# EAGLE design alfred-core (EAGLE 7.3.0)
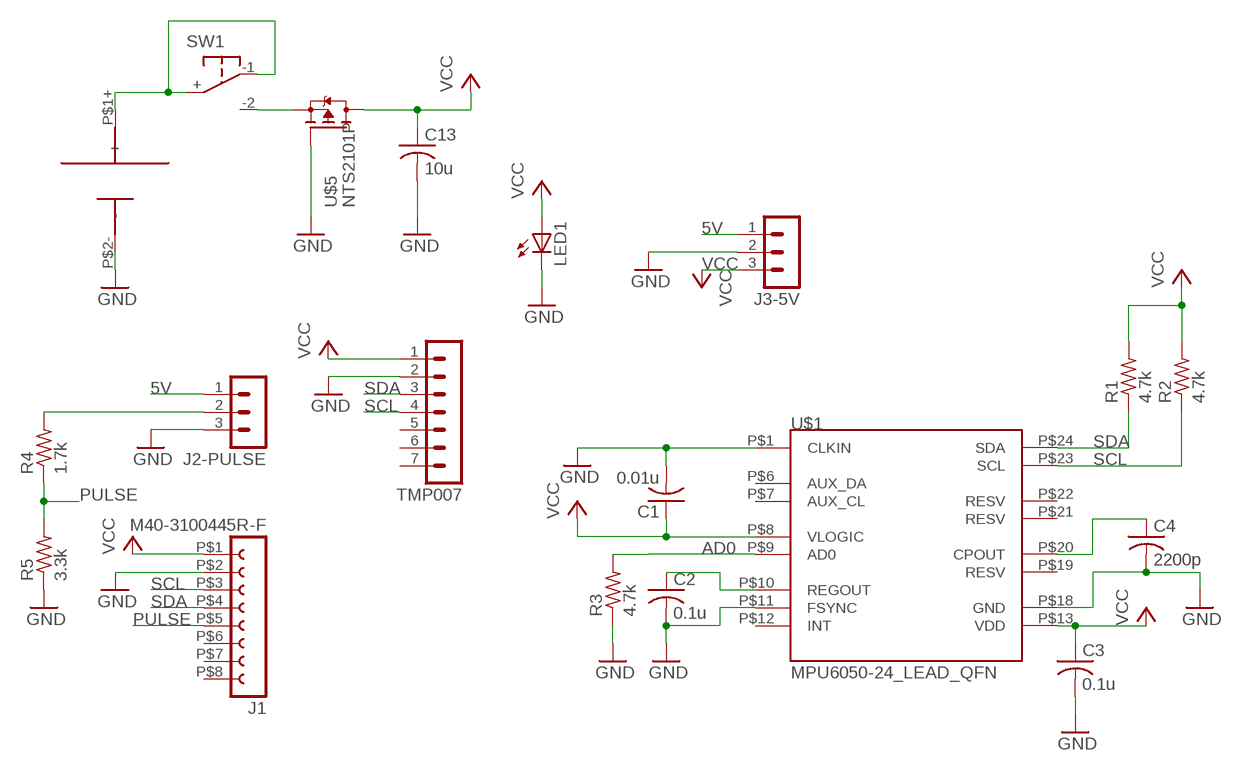
[diagram p0: schematic, sheet 1]

## Parts
BAT1  CR2032HOLDER  [CR2032-HOLDER]
C1  0.01u  C-USC0603  [C0603]
C2  0.1u  C-USC0603  [C0603]
C3  0.1u  C-USC0603  [C0603]
C4  2200p  C-USC0603  [C0603]
C13  10u  C-USC0603  [C0603]
J1  M40-3100445R-F  [8-PO-F]
J2-PULSE  MA03-1  [MA03-1]
J3-5V  MA03-1  [MA03-1]
LED1  LEDCHIPLED_0603  [CHIPLED_0603]
R1  4.7k  R-US_R0603  [R0603]
R2  4.7k  R-US_R0603  [R0603]
R3  4.7k  R-US_R0603  [R0603]
R4  1.7k  R-US_R0603  [R0603]
R5  3.3k  R-US_R0603  [R0603]
SW1  JS102011SAQN  [JS102011SAQN]
TMP007  MA07-1  [MA07-1]
U$1  MPU6050-24_LEAD_QFN  [24_LEAD_QFN(4X4X0.9)]
U$5  NTS2101P  [SOT323]

## Nets
5V: J2-PULSE.1 J3-5V.1
AD0: R3.2 U$1.P$9(AD0)
GND: BAT1.P$2-(-) C1.2 C2.2 C3.2 C4.2 C13.2 J1.P$2 J2-PULSE.3 J3-5V.2 LED1.C R3.1 R5.1 TMP007.2 U$1.P$1(CLKIN) U$1.P$11(FSYNC) U$1.P$18(GND) U$5.G
N$1: C2.1 U$1.P$10(REGOUT)
N$2: C4.1 U$1.P$20(CPOUT)
N$5: J2-PULSE.2 R4.2
N$8: BAT1.P$1+(+) SW1.+ SW1.-1
N$10: SW1.-2 U$5.S
PULSE: J1.P$5 R4.1 R5.2
SCL: J1.P$3 R2.1 TMP007.4 U$1.P$23(SCL)
SDA: J1.P$4 R1.1 TMP007.3 U$1.P$24(SDA)
VCC: C1.1 C3.1 C13.1 J1.P$1 J3-5V.3 LED1.A R1.2 R2.2 TMP007.1 U$1.P$8(VLOGIC) U$1.P$13(VDD) U$5.D
Unconnected: J1.P$6 J1.P$7 J1.P$8 TMP007.5 TMP007.6 TMP007.7 U$1.P$6(AUX_DA) U$1.P$7(AUX_CL) U$1.P$12(INT) U$1.P$19(RESV) U$1.P$21(RESV) U$1.P$22(RESV)

## Library data of the parts
BAT1 = adafruit:CR2032HOLDER
C1-C4 C13 = adafruit:C-US: CAPACITOR, American symbol
J1 = board-to-board-conn:M40-3100445R-F
J2-PULSE J3-5V = con-lstb:MA03-1: PIN HEADER; OC_FARNELL: unknown; OC_NEWARK: unknown
LED1 = adafruit:LED: LED OSRAM: - CHIPLED LG R971, LG N971, LY N971, LG Q971, LY Q971, LO R971, LY R971 LH N974, LH R974 LS Q976, LO Q976, LY Q976 LO Q996 - Hyper CHIPLED LW Q18S LB Q993, LB Q99A, LB R99A - SideLED LS A670, LO A670, LY A670, LG A670, LP A670 LB A673, LV A673, LT A673, LW A673 LH A674 LY A675 LS A676, LA A676, LO A676, LY A676, LW A676 LS A679, LY A679, LG A679 - Hyper Micro SIDELED® LS Y876, LA Y876, LO Y876, LY Y876 LT Y87S - SmartLED LW L88C, LW L88S LB L89C, LB L89S, LG L890 LS L89K, LO L89K, LY L89K LS L896, LA L896, LO L896, LY L896 - TOPLED LS T670, LO T670, LY T670, LG T670, LP T670 LSG T670, LSP T670, LSY T670, LOP T670, LYG T670 LG T671, LOG T671, LSG T671 LB T673, LV T673, LT T673, LW T673 LH T674 LS T676, LA T676, LO T676, LY T676, LB T676, LH T676, LSB T676, LW T676 LB T67C, LV T67C, LT T67C, LS T67K, LO T67K, LY T67K, LW E67C LS E67B, LA E67B, LO E67B, LY E67B, LB E67C, LV E67C, LT E67C LW T67C LS T679, LY T679, LG T679 LS T770, LO T770, LY T770, LG T770, LP T770 LB T773, LV T773, LT T773, LW T773 LH T774 LS E675, LA E675, LY E675, LS T675 LS T776, LA T776, LO T776, LY T776, LB T776 LHGB T686 LT T68C, LB T68C - Hyper Mini TOPLED® LB M676 - Mini TOPLED Santana® LG M470 LS M47K, LO M47K, LY M47K Source: http://www.osram.convergy.de/
R1-R5 = adafruit:R-US_: RESISTOR, American symbol
SW1 = Switched:JS102011SAQN
TMP007 = con-lstb:MA07-1: PIN HEADER; OC_FARNELL: unknown; OC_NEWARK: unknown
U$1 = MPU6050:MPU6050-24_LEAD_QFN
U$5 = adafruit:NTS2101P

## Board
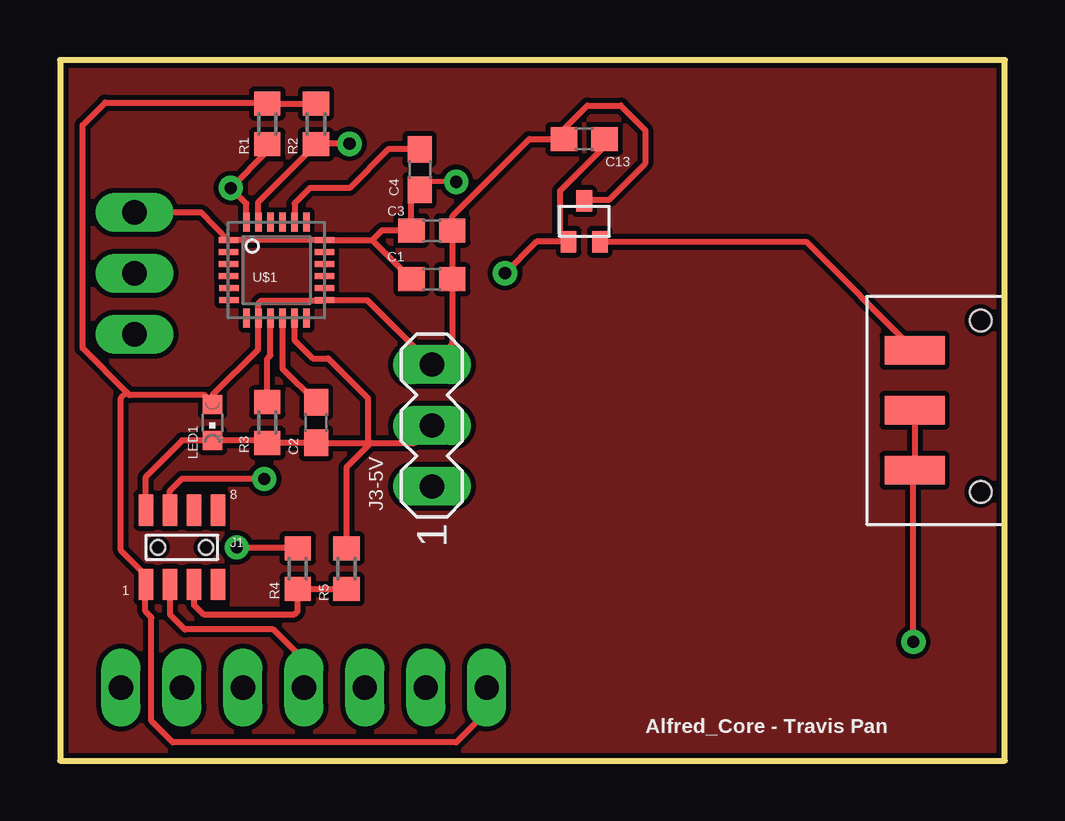
[diagram p1: board, top side]
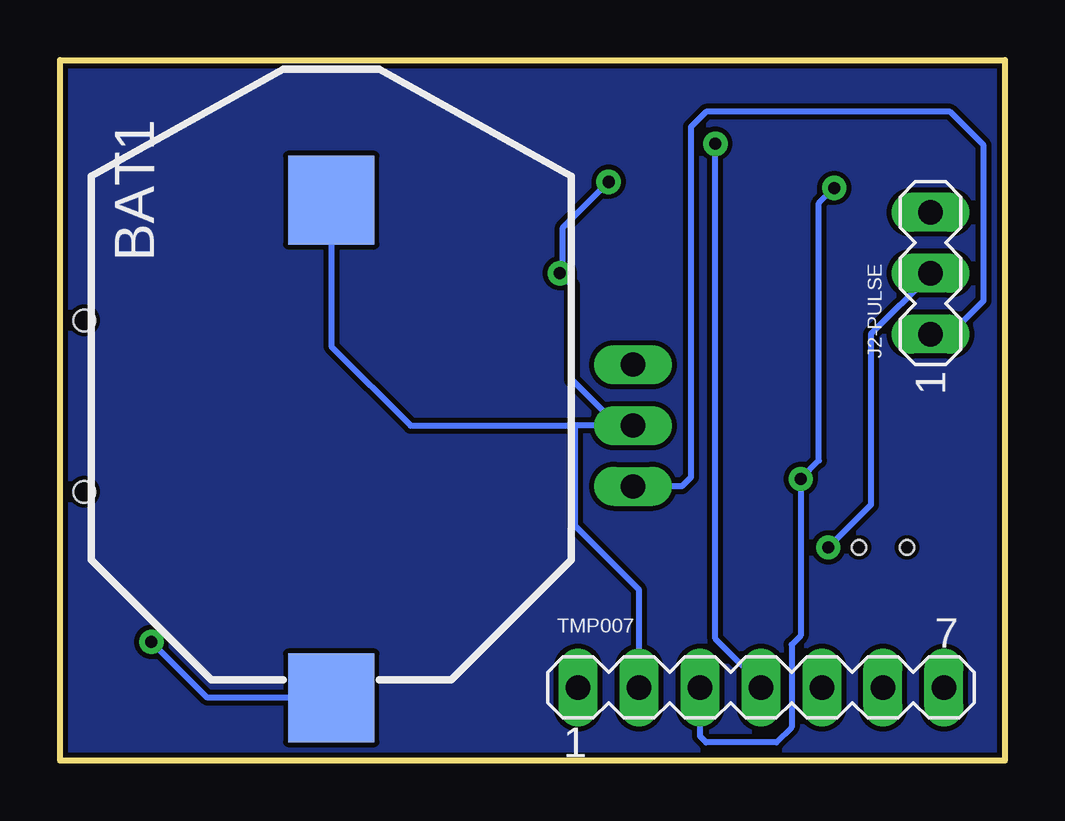
[diagram p2: board, bottom side, seen from below]

Size 39.37 x 29.21 mm. Coordinates in mm from the lower left corner, seen from the top.
Outline: 0,0 39.37,0 39.37,29.21 0,29.21 0,0
Copper layers (1*16): Top 0.035mm / dielectric 1.5mm / Bottom 0.035mm
Design rules "SparkFun": minimum track width 8mil, minimum drill 20mil, track to track 8mil, track to pad 8mil, pad to pad 8mil, via to via 8mil, smd to smd 8mil, copper to edge 8mil, drill to drill 8mil, minimum pad ring 12mil, minimum via ring 10mil, stop-mask expansion 4mil, vias tented up to drill 20mil, thermal gap 10mil

### Footprints (pad centres in the part's own frame; a part is rotated, then mirrored left to right if it is on the bottom)
CR2032-HOLDER = smd 3.7 x 3.6: P$1+ -20.75,0; P$2- 0,0
C0603 = smd 1.1 x 1: 1 -0.85,0; 2 0.85,0
8-PO-F = smd 0.6 x 1.3: P$1 -1.5,-1.55; P$2 -1.5,1.55; P$3 -0.5,-1.55; P$4 -0.5,1.55; P$5 0.5,-1.55; P$6 0.5,1.55; P$7 1.5,-1.55; P$8 1.5,1.55 | hole 0.6: -1,0; 1,0
MA03-1 = drill 1.016 long: 1 -2.54,0; 2 0,0; 3 2.54,0
CHIPLED_0603 = smd 0.8 x 0.8: A 0,-0.75; C 0,0.75
R0603 = smd 1 x 1.1: 1 -0.85,0; 2 0.85,0
JS102011SAQN = smd 1.2 x 2.5: + 0,0; -1 -2.5,0; -2 2.5,0 | hole 0.9: -3.4,-2.75; 3.75,-2.75
MA07-1 = drill 1.016 long: 1 -7.62,0; 2 -5.08,0; 3 -2.54,0; 4 0,0; 5 2.54,0; 6 5.08,0; 7 7.62,0
24_LEAD_QFN(4X4X0.9) = smd 0.8 x 0.26: P$1 -2,1.25; P$2 -2,0.75; P$3 -2,0.25; P$4 -2,-0.25; P$5 -1.975,-0.75; P$6 -1.975,-1.25; P$13 2,-1.25; P$14 2,-0.75; P$15 2,-0.25; P$16 2,0.25; P$17 2,0.75; P$18 2,1.25 | smd 0.26 x 0.8: P$7 -1.25,-2; P$8 -0.75,-2; P$9 -0.25,-2; P$10 0.25,-2; P$11 0.75,-2; P$12 1.25,-2; P$19 1.25,2; P$20 0.75,2; P$21 0.25,2; P$22 -0.25,2; P$23 -0.75,2; P$24 -1.25,2
SOT323 = smd 0.65 x 0.9: D 0,-0.85; G 0.65,0.85; S -0.65,0.85

### Placement (x,y rotation side)
BAT1  28.07,23.37 90 bottom
C1  15.49,20.07 180 top
C2  10.67,14.1 270 top
C3  15.49,22.1 180 top
C4  14.99,24.64 270 top
C13  21.84,25.91 0 top
J1  5.08,8.89 0 top
J2-PULSE  3.1,20.32 90 bottom
J3-5V  15.49,13.97 90 top
LED1  6.35,14.1 180 top
R1  8.64,26.54 90 top
R2  10.67,26.54 90 top
R3  8.64,14.1 90 top
R4  9.91,8 90 top
R5  11.94,8 270 top
SW1  35.61,14.61 90 top
TMP007  10.16,3.05 0 bottom
U$1  9.02,20.45 0 top
U$5  21.84,22.48 180 top

### Tracks (layer width: path | path; a pad name or v marks a point on that pad's centre or on a via)
5V
  Bottom 0.254: J2-PULSE.1 2.29,17.78 0.89,19.18 0.89,25.65 2.29,27.05 12.45,27.05 13.08,26.42 13.08,11.81 13.46,11.43 J3-5V.1
AD0
  Top 0.254: R3.2 8.64,16.76 8.76,16.89 8.76,18.47 U$1.P$9
GND  (via drill 0.51)
  Top 0.203: 15.24,23.5 C4.2 15.24,24.13 v16.51,24.13
  Top 0.254: J2-PULSE.3 5.88,22.86 U$1.P$1 U$1.P$18 13.01,21.7 | C4.2 14.64,23.45 C3.2 13.41,22.1 13.01,21.7 | 12.95,13.25 C2.2 R3.1 8.54,13.35 LED1.C 5.09,13.35 3.58,11.84 J1.P$2 | 12.95,13.25 14.77,13.25 J3-5V.2 | U$1.P$11 9.77,17.54 10.54,16.76 11.18,16.76 12.83,15.11 12.83,13.37 12.95,13.25 | 13.01,21.7 C1.2 | R5.1 11.94,12.23 12.95,13.25 | v18.54,20.32 19.85,21.63 U$5.G 20.83,22 20.83,23.75 22.69,25.61 C13.2
  Bottom 0.203: 18.41,20.32 v18.54,20.32
  Bottom 0.254: J3-5V.2 18.03,13.97 | TMP007.2 15.24,7.11 17.91,9.78 17.91,13.84 18.03,13.97 | 15.11,13.59 J3-5V.2 | v16.51,24.13 18.41,22.23 18.41,20.32 | J3-5V.2 16.13,13.97 18.03,15.88 18.03,19.81 v18.54,20.32 | BAT1.P$2- 28.07,17.27 24.77,13.97 18.03,13.97
N$1
  Top 0.254: U$1.P$10 9.27,16.35 C2.1
N$2
  Top 0.254: C4.1 13.68,25.49 12.06,23.88 10.41,23.88 9.78,23.24 U$1.P$20
N$3
  pour Top: 0,0 39.37,0 39.37,29.21 0,29.21
N$4
  pour Bottom: 0,0 39.37,0 39.37,29.21 0,29.21
N$5  (via drill 0.5)
  Top 0.254: v7.37,8.89 9.87,8.89 R4.2
  Bottom 0.254: J2-PULSE.2 3.1,20.27 5.59,17.78 5.59,10.67 v7.37,8.89
N$8  (via drill 0.5)
  Top 0.254: SW1.+ SW1.-1 35.56,12.05 v35.56,4.95
  Bottom 0.254: BAT1.P$1+ 33.23,2.62 v35.56,4.95
N$10
  Top 0.254: U$5.S 31.09,21.63 SW1.-2
PULSE
  Top 0.254: J1.P$5 5.58,6.49 5.97,6.1 9.78,6.1 9.91,6.22 R4.1 R5.2
SCL  (via drill 0.51)
  Top 0.203: 10.79,25.72 R2.1
  Top 0.254: U$1.P$23 8.27,23.29 R2.1 | TMP007.4 10.16,4.19 8.89,5.46 5.21,5.46 4.58,6.09 J1.P$3 | v12.06,25.72 10.79,25.72
  Bottom 0.203: 10.16,3.17 TMP007.4
  Bottom 0.254: v12.06,25.72 12.06,5.08 10.16,3.17
SDA  (via drill 0.5)
  Top 0.254: v8.51,11.75 5.08,11.75 4.58,11.25 J1.P$4 | R1.1 8.64,25.4 v7.11,23.88 7.77,23.22 U$1.P$24
  Bottom 0.254: v7.11,23.88 7.75,23.24 7.75,12.51 v8.51,11.75 8.51,5.21 8.89,4.83 8.89,1.4 9.53,0.76 12.45,0.76 12.7,1.02 TMP007.3
VCC
  Top 0.203: 6.03,15.24 LED1.A | 8.57,27.3 R1.2 | 17.78,2.54 TMP007.1
  Top 0.254: R2.2 R1.2 8.6,27.43 1.88,27.43 0.94,26.49 0.94,17.2 2.78,15.35 | LED1.A 6.35,15.24 8.26,17.14 8.26,18.46 U$1.P$8 8.27,19.06 8.38,19.18 11,19.18 U$1.P$13 12.81,19.2 J3-5V.3 16.34,17.36 C1.1 C3.1 16.34,22.69 19.56,25.91 C13.1 20.99,26.33 21.97,27.3 23.37,27.3 24.38,26.29 24.38,24.89 22.86,23.37 21.88,23.37 U$5.D | 6.03,15.24 2.9,15.24 2.78,15.35 | 2.78,15.35 2.54,15.11 2.54,8.76 3.58,7.72 J1.P$1 3.56,7.32 3.56,6.22 3.81,5.97 3.81,1.65 4.7,0.76 16.51,0.76 17.78,2.03 17.78,2.54 17.78,2.86

### Text on the board
tPlace: Alfred_Core - Travis Pan